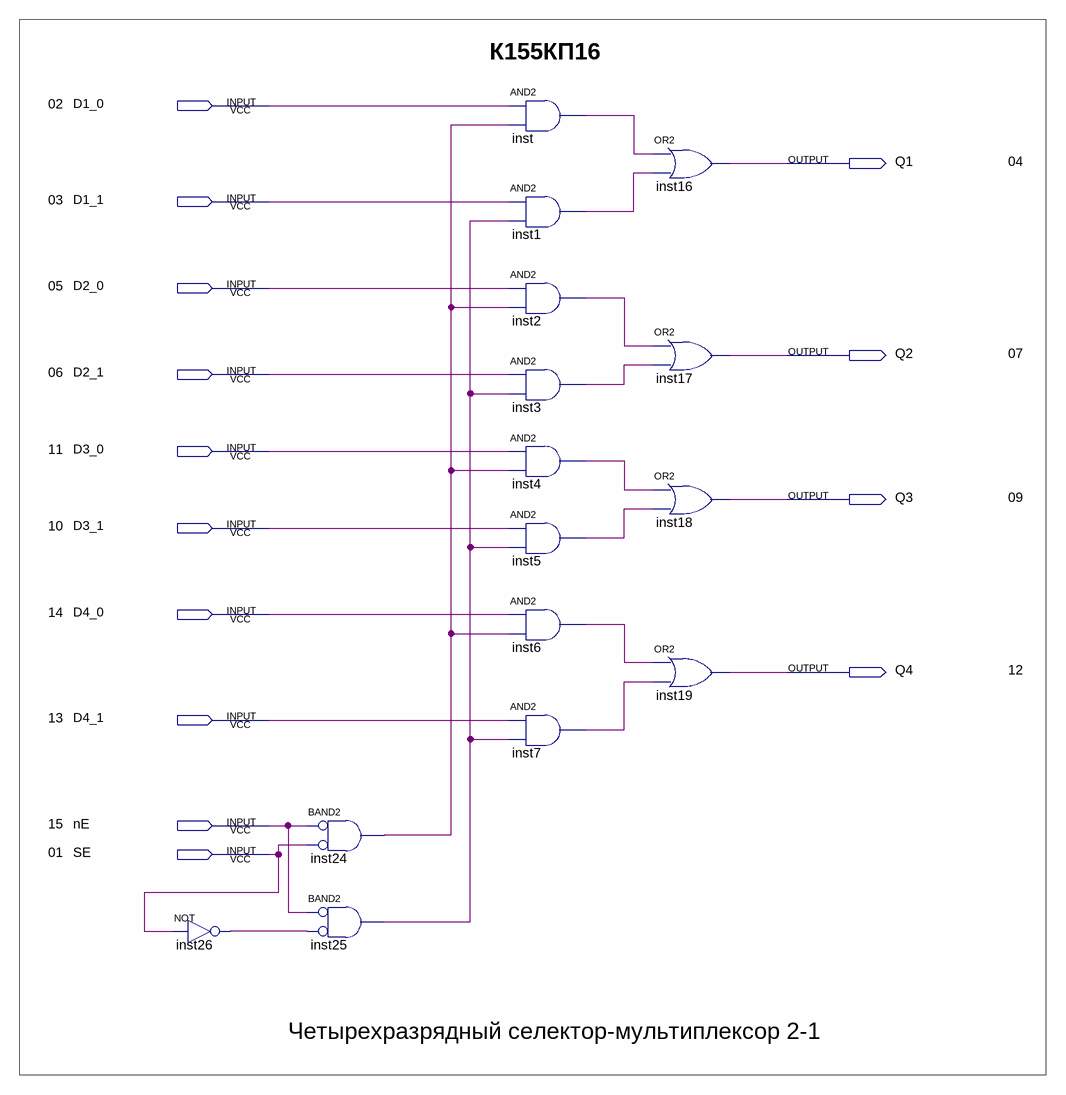
[diagram p0: schematic sheet]
// Quartus schematic K155KP16.bdf as structural Verilog: 15 symbols, 14 pins
module K155KP16 (
  input  D1_0,
  input  D1_1,
  input  D2_0,
  input  D2_1,
  input  D3_0,
  input  D3_1,
  input  D4_0,
  input  D4_1,
  input  nE,
  input  SE,
  output Q1,
  output Q2,
  output Q3,
  output Q4
);

  wire inst1_out, inst2_out, inst3_out, inst4_out, inst5_out, inst6_out, inst7_out, inst24_out, inst25_out,
       inst26_out, inst_out;

  not inst26 (inst26_out, SE);
  and inst24 (inst24_out, ~nE, ~SE);  // BAND2
  and inst25 (inst25_out, ~nE, ~inst26_out);  // BAND2
  and inst (inst_out, D1_0, inst24_out);
  and inst1 (inst1_out, D1_1, inst25_out);
  and inst2 (inst2_out, D2_0, inst24_out);
  and inst3 (inst3_out, D2_1, inst25_out);
  and inst4 (inst4_out, D3_0, inst24_out);
  and inst5 (inst5_out, D3_1, inst25_out);
  and inst6 (inst6_out, D4_0, inst24_out);
  and inst7 (inst7_out, D4_1, inst25_out);
  or inst16 (Q1, inst_out, inst1_out);
  or inst17 (Q2, inst2_out, inst3_out);
  or inst18 (Q3, inst4_out, inst5_out);
  or inst19 (Q4, inst6_out, inst7_out);

  // Notes on the sheet:
  //   К155КП16
  //   02
  //   04
  //   03
  //   05
  //   07
  //   06
  //   11
  //   09
  //   10
  //   14
  //   12
  //   13
  //   15
  //   01
  //   Четырехразрядный селектор-мультиплексор 2-1
endmodule
